# Altium schematic sheet tuya.SchDoc
size A4; SheetNumber: 1; SheetTotal: 1
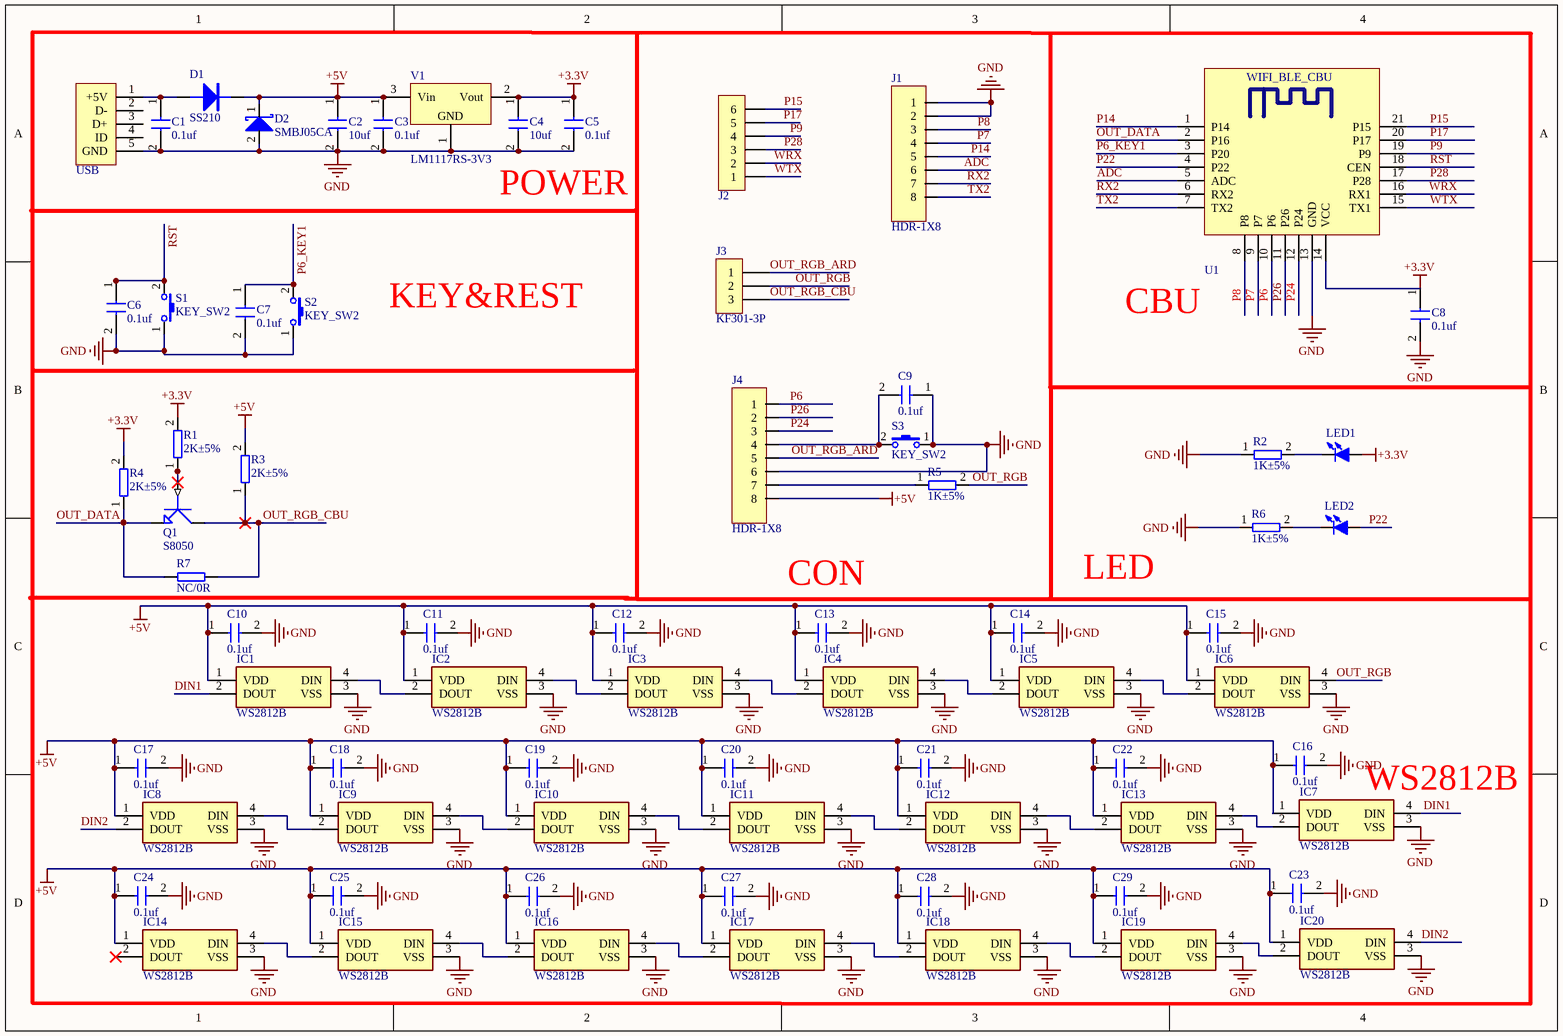
[diagram p0: tuya.SchDoc]

## Parts
C1  0.1uf  [C 0402_M]
C2  10uf  [C 0603_M]
C3  0.1uf  [C 0402_M]
C4  10uf  [C 0603_M]
C5  0.1uf  [C 0402_M]
C6  0.1uf  [C 0402_M]
C7  0.1uf  [C 0402_M]
C8  0.1uf  [C 0402_M]
C9  0.1uf  [C 0402_M]
C10  0.1uf  [C 0402_M]
C11  0.1uf  [C 0402_M]
C12  0.1uf  [C 0402_M]
C13  0.1uf  [C 0402_M]
C14  0.1uf  [C 0402_M]
C15  0.1uf  [C 0402_M]
C16  0.1uf  [C 0402_M]
C17  0.1uf  [C 0402_M]
C18  0.1uf  [C 0402_M]
C19  0.1uf  [C 0402_M]
C20  0.1uf  [C 0402_M]
C21  0.1uf  [C 0402_M]
C22  0.1uf  [C 0402_M]
C23  0.1uf  [C 0402_M]
C24  0.1uf  [C 0402_M]
C25  0.1uf  [C 0402_M]
C26  0.1uf  [C 0402_M]
C27  0.1uf  [C 0402_M]
C28  0.1uf  [C 0402_M]
C29  0.1uf  [C 0402_M]
D1  SS210  [SMA(DO-214AC)]
D2  SMBJ05CA  [SMB(DO-214AA)]
IC1  WS2812B  [COM16346]
IC2  WS2812B  [COM16346]
IC3  WS2812B  [COM16346]
IC4  WS2812B  [COM16346]
IC5  WS2812B  [COM16346]
IC6  WS2812B  [COM16346]
IC7  WS2812B  [COM16346]
IC8  WS2812B  [COM16346]
IC9  WS2812B  [COM16346]
IC10  WS2812B  [COM16346]
IC11  WS2812B  [COM16346]
IC12  WS2812B  [COM16346]
IC13  WS2812B  [COM16346]
IC14  WS2812B  [COM16346]
IC15  WS2812B  [COM16346]
IC16  WS2812B  [COM16346]
IC17  WS2812B  [COM16346]
IC18  WS2812B  [COM16346]
IC19  WS2812B  [COM16346]
IC20  WS2812B  [COM16346]
J1  HDR-1X8  [HDR2.54-LI-8P]
J2  HDR-1X6  [HDR2.54-LI-6P]  (value not drawn)
J3  KF301-3P  [HDR2.54-LI-3P]
J4  HDR-1X8  [HDR2.54-LI-8P]
LED1  LED  [LED 0805B]  (value not drawn)
LED2  LED  [LED 0805B]  (value not drawn)
Q1  S8050  [SOT-23-NPN]
R1  2K±5%  [0603R]
R2  1K±5%  [0603R]
R3  2K±5%  [0603R]
R4  2K±5%  [0603R]
R5  1K±5%  [0603R]
R6  1K±5%  [0603R]
R7  NC/0R  [0603R]
S1  KEY_SW2  [TSW SMD-4*4*1.5]
S2  KEY_SW2  [TSW SMD-4*4*1.5]
S3  KEY_SW2  [TSW SMD-4*4*1.5]
U1  WIFI_BLE_CBU  [WIFI_BLE_CBU]  (value not drawn)
USB  USB-5P  [USB-MICRO_D]  (value not drawn)
V1  LM1117RS-3V3  [SOT223_M]

## Nets
+3.3V: C4.1 C5.1 LED1.1(A) R1.2 R4.2 U1.14(VCC) V1.2(Vout)
+5V: C2.1 C3.1 C10.1 C11.1 C12.1 C13.1 C14.1 C15.1 C16.1 C17.1 C18.1 C19.1 C20.1 C21.1 C22.1 C23.1 C24.1 C25.1 C26.1 C27.1 C28.1 C29.1 D1.2 D2.1 IC1.1(VDD) IC2.1(VDD) IC3.1(VDD) IC4.1(VDD) IC5.1(VDD) IC6.1(VDD) IC7.1(VDD) IC8.1(VDD) IC9.1(VDD) IC10.1(VDD) IC11.1(VDD) IC12.1(VDD) IC13.1(VDD) IC14.1(VDD) IC15.1(VDD) IC16.1(VDD) IC17.1(VDD) IC18.1(VDD) IC19.1(VDD) IC20.1(VDD) J4.8 R3.2 V1.3(Vin)
GND: C1.2 C2.2 C3.2 C4.2 C5.2 C6.2 C7.2 C8.2 C9.1 C10.2 C11.2 C12.2 C13.2 C14.2 C15.2 C16.2 C17.2 C18.2 C19.2 C20.2 C21.2 C22.2 C23.2 C24.2 C25.2 C26.2 C27.2 C28.2 C29.2 D2.2 IC1.3(VSS) IC2.3(VSS) IC3.3(VSS) IC4.3(VSS) IC5.3(VSS) IC6.3(VSS) IC7.3(VSS) IC8.3(VSS) IC9.3(VSS) IC10.3(VSS) IC11.3(VSS) IC12.3(VSS) IC13.3(VSS) IC14.3(VSS) IC15.3(VSS) IC16.3(VSS) IC17.3(VSS) IC18.3(VSS) IC19.3(VSS) IC20.3(VSS) J1.1 J1.2 J4.6 R2.1 R6.1 S1.1 S2.1 S3.1 U1.13(GND) USB.5(GND) V1.1(GND)
ADC: J1.6 U1.5(ADC)
DIN1: IC1.2(DOUT) IC7.4(DIN)
DIN2: IC8.2(DOUT) IC20.4(DIN)
OUT_DATA: Q1.1(E) R4.1 R7.1 U1.2(P16)
OUT_RGB: IC6.4(DIN) J3.2 R5.2
OUT_RGB_ARD: J3.1 J4.5
OUT_RGB_CBU: J3.3 Q1.3(C) R3.1 R7.2
P6: J4.1 U1.10(P6)
P6_KEY1: C7.1 S2.2 U1.3(P20)
P7: J1.4 U1.9(P7)
P8: J1.3 U1.8(P8)
P9: J2.4 U1.19(P9)
P14: J1.5 U1.1(P14)
P15: J2.6 U1.21(P15)
P17: J2.5 U1.20(P17)
P22: LED2.1(A) U1.4(P22)
P24: J4.3 U1.12(P24)
P26: J4.2 U1.11(P26)
P28: J2.3 U1.17(P28)
RST: C6.1 S1.2 U1.18(CEN)
RX2: J1.7 U1.6(RX2)
TX2: J1.8 U1.7(TX2)
WRX: J2.2 U1.16(RX1)
WTX: J2.1 U1.15(TX1)
NetC1_1: C1.1 D1.1 USB.1(+5V)
NetC9_2: C9.2 J4.4 S3.2
NetIC1_4: IC1.4(DIN) IC2.2(DOUT)
NetIC2_4: IC2.4(DIN) IC3.2(DOUT)
NetIC3_4: IC3.4(DIN) IC4.2(DOUT)
NetIC4_4: IC4.4(DIN) IC5.2(DOUT)
NetIC5_4: IC5.4(DIN) IC6.2(DOUT)
NetIC7_2: IC7.2(DOUT) IC13.4(DIN)
NetIC8_4: IC8.4(DIN) IC9.2(DOUT)
NetIC9_4: IC9.4(DIN) IC10.2(DOUT)
NetIC10_4: IC10.4(DIN) IC11.2(DOUT)
NetIC11_4: IC11.4(DIN) IC12.2(DOUT)
NetIC12_4: IC12.4(DIN) IC13.2(DOUT)
NetIC14_4: IC14.4(DIN) IC15.2(DOUT)
NetIC15_4: IC15.4(DIN) IC16.2(DOUT)
NetIC16_4: IC16.4(DIN) IC17.2(DOUT)
NetIC17_4: IC17.4(DIN) IC18.2(DOUT)
NetIC18_4: IC18.4(DIN) IC19.2(DOUT)
NetIC19_4: IC19.4(DIN) IC20.2(DOUT)
NetJ4_7: J4.7 R5.1
NetLED1_2: LED1.2(K) R2.2
NetLED2_2: LED2.2(K) R6.2
NetQ1_2: Q1.2(B) R1.1

Not connected (* = marked no-connect by the designer): C8 1; IC14 2(DOUT)*; USB 2(D-) 3(D+) 4(ID)

## Notes on the sheet
- POWER
- KEY&REST
- (near U1) CBU
- LED
- CON
- (near IC7) WS2812B

## Library data of the parts
C1 C3 C5-C29 = CAP: 电容
C2 C4 = CAP_1: 电容
D1 = Diode
D2 = D Schottky: Schottky Diode; MFR: Toshiba
IC1-IC20 = WS2812B: Integrated Circuit; Manufacturer_Name: SparkFun; Manufacturer_Part_Number: COM-16346; Datasheet Link: http://cdn.sparkfun.com/datasheets/BreakoutBoards/WS2812B.pdf; Height: 2.25mm; Mouser Part Number: 474-COM-16346; Mouser Price/Stock: https://www.mouser.co.uk/ProductDetail/SparkFun/COM-16346?qs=OlC7AqGiEDnspdV1Dchx7w%3D%3D
J1 J4 = CON8: connector
J2 = CON6: connector; BOM名称: 6P接插件; 版权归属: 源创客; 学习资源: www.ooocke.com
J3 = CON3: Connector
LED1 LED2 = LED-SMD: 贴片LED; 版权归属: 源创客; BOM名称: 贴片LED; 学习资源: www.ooocke.com
Q1 = NPN: NPN Transistor
R1 R3 R4 = RES_1: 电阻
R2 R5 R6 = RES_2: 电阻
R7 = RES5
U1 = WIFI_BLE_CBU: Module
USB = USB-5P: 微型USB母座; 版权归属: 源创客; BOM名称: 微型USB母座; 学习资源: www.ooocke.com
V1 = LM1117RS: 三端稳压芯片; BOM名称: 稳压芯片; 版权归属: 源创客; 学习资源: www.ooocke.com